# EAGLE design eTapper1main48 (EAGLE 8.4.3)
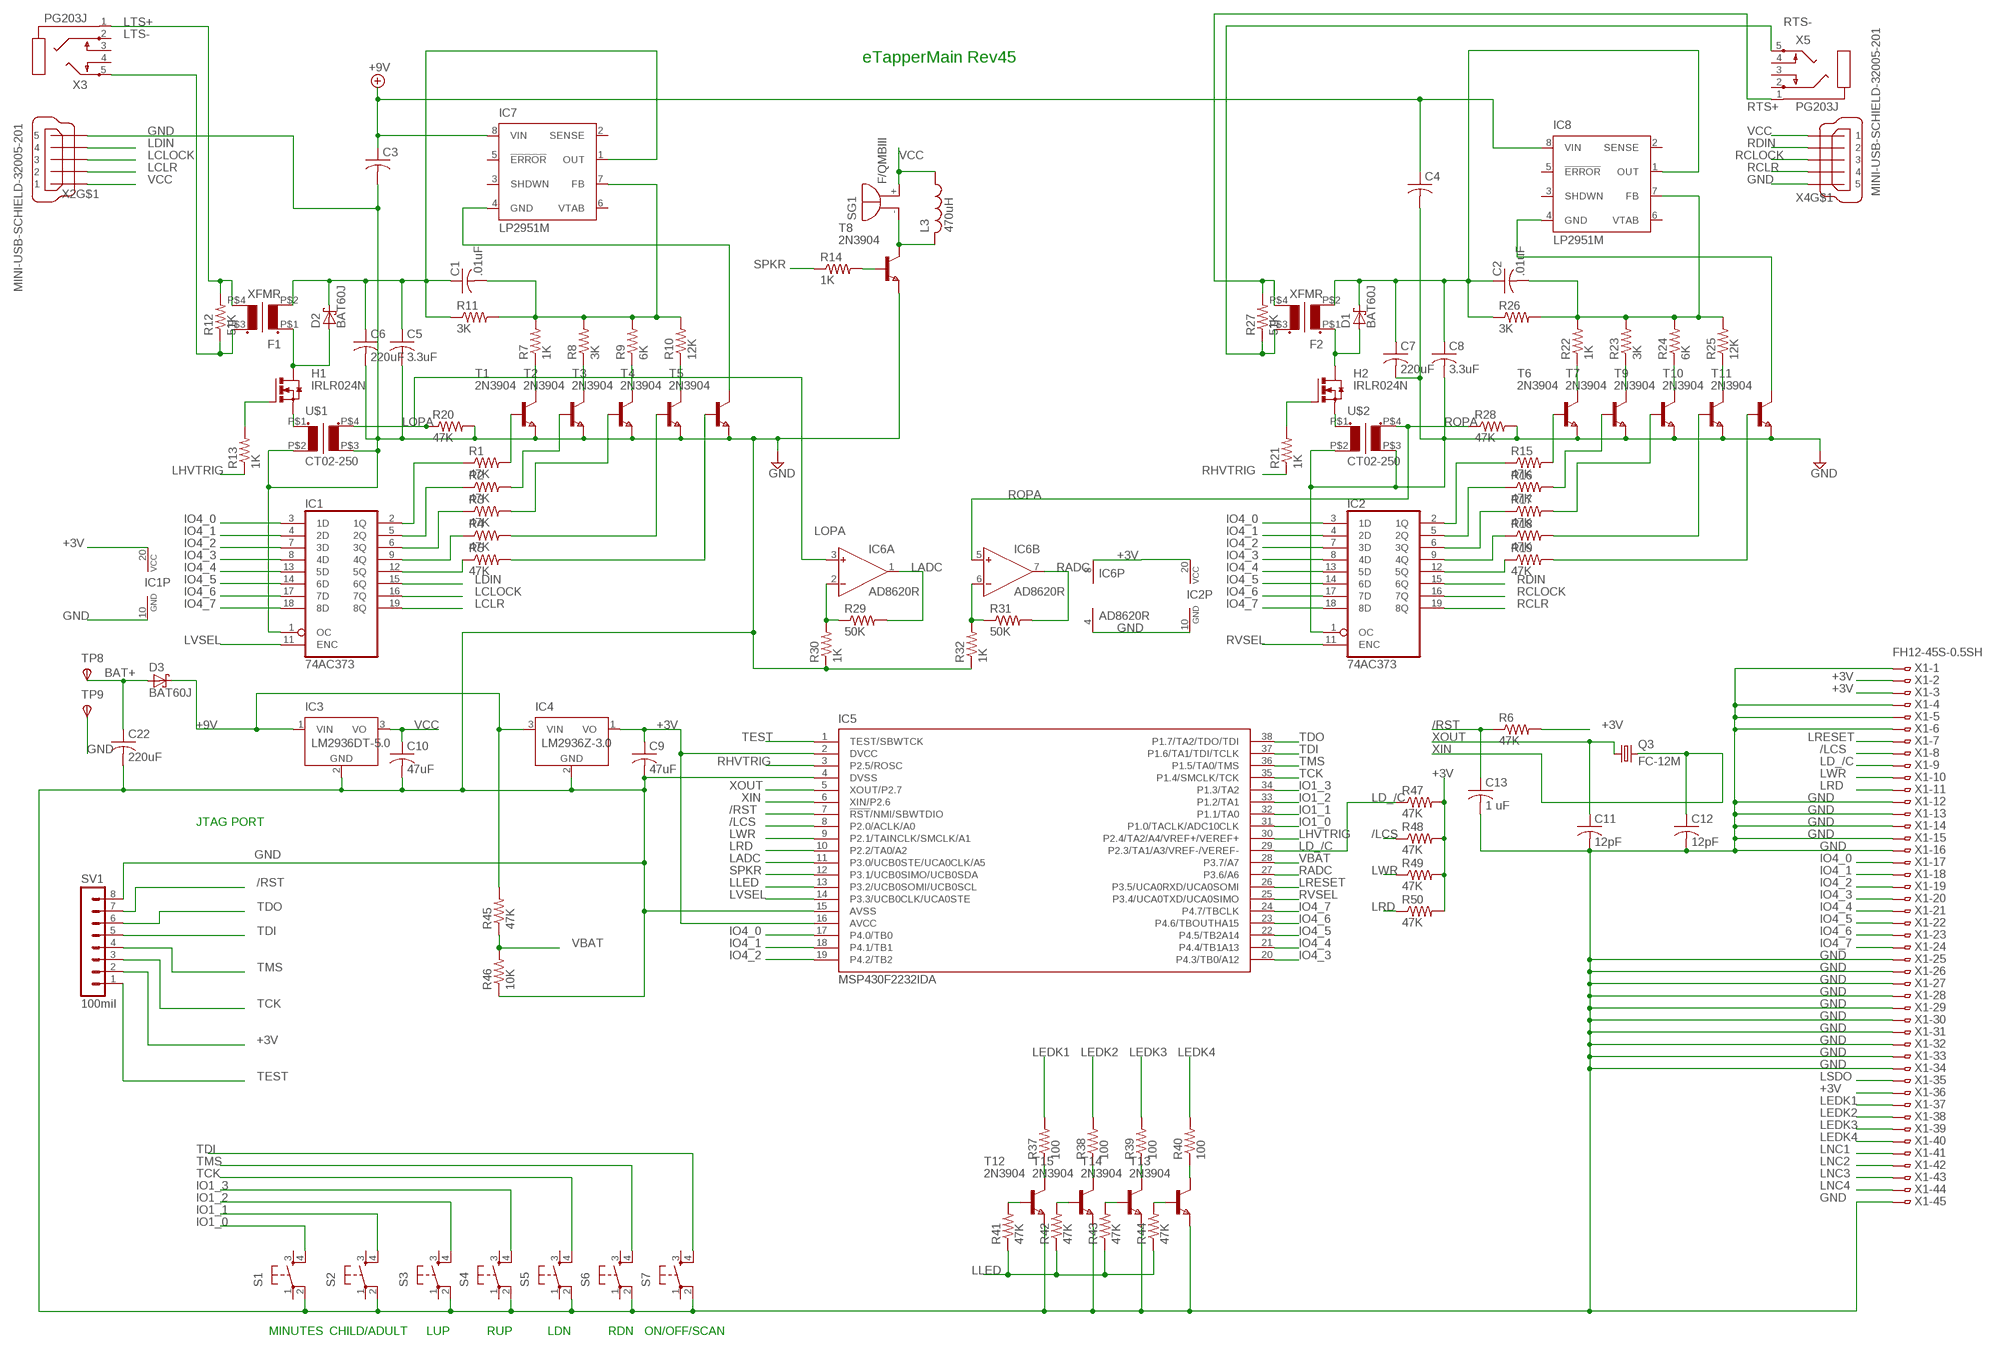
[diagram p0: schematic, sheet 1]

## Parts
C1  .01uF  C-USC0805  [C0805]
C2  .01uF  C-USC0805  [C0805]
C3  C-USC1206  [C1206]
C4  C-USC1206  [C1206]
C5  3.3uF  C-USC0805  [C0805]
C6  220uF  C-USC1206  [C1206]
C7  220uF  C-USC1206  [C1206]
C8  3.3uF  C-USC0805  [C0805]
C9  47uF  C-USC1206  [C1206]
C10  47uF  C-USC1206  [C1206]
C11  12pF  C-USC0805  [C0805]
C12  12pF  C-USC0805  [C0805]
C13  1 uF  C-USC0805  [C0805]
C22  220uF  C-USC1206  [C1206]
D1  BAT60J  [SOD323_ST]
D2  BAT60J  [SOD323_ST]
D3  BAT60J  [SOD323_ST]
F1  XFMR  [XFMR]
F2  XFMR  [XFMR]
H1  IRLR024N  [D-PAK_TO252AA]
H2  IRLR024N  [D-PAK_TO252AA]
IC1  74AC373  [SO20]
IC2  74AC373  [SO20]
IC3  LM2936DT-5.0  [TO252]
IC4  LM2936Z-3.0  [TO92]
IC5  MSP430F2232IDA  [TSSOP38_R-PDSO-G38-DA]
IC6  AD8620R  [SO8]
IC7  LP2951M  [SO08]
IC8  LP2951M  [SO08]
L3  470uH  L-USL2825P  [L2825P]
Q3  FC-12M  [FC-12M]
R1  47K  R-US_R0402  [R0402]
R2  47K  R-US_R0402  [R0402]
R3  47K  R-US_R0402  [R0402]
R4  47K  R-US_R0402  [R0402]
R5  47K  R-US_R0402  [R0402]
R6  47K  R-US_R0402  [R0402]
R7  1K  R-US_R0402  [R0402]
R8  3K  R-US_R0402  [R0402]
R9  6K  R-US_R0402  [R0402]
R10  12K  R-US_R0402  [R0402]
R11  3K  R-US_R0402  [R0402]
R12  51K  R-US_R0402  [R0402]
R13  1K  R-US_R0402  [R0402]
R14  1K  R-US_R0402  [R0402]
R15  47K  R-US_R0402  [R0402]
R16  47K  R-US_R0402  [R0402]
R17  47K  R-US_R0402  [R0402]
R18  47K  R-US_R0402  [R0402]
R19  47K  R-US_R0402  [R0402]
R20  47K  R-US_R0402  [R0402]
R21  1K  R-US_R0402  [R0402]
R22  1K  R-US_R0402  [R0402]
R23  3K  R-US_R0402  [R0402]
R24  6K  R-US_R0402  [R0402]
R25  12K  R-US_R0402  [R0402]
R26  3K  R-US_R0402  [R0402]
R27  51K  R-US_R0402  [R0402]
R28  47K  R-US_R0402  [R0402]
R29  50K  R-US_R0402  [R0402]
R30  1K  R-US_R0402  [R0402]
R31  50K  R-US_R0402  [R0402]
R32  1K  R-US_R0402  [R0402]
R37  100  R-US_R0402  [R0402]
R38  100  R-US_R0402  [R0402]
R39  100  R-US_R0402  [R0402]
R40  100  R-US_R0402  [R0402]
R41  47K  R-US_R0402  [R0402]
R42  47K  R-US_R0402  [R0402]
R43  47K  R-US_R0402  [R0402]
R44  47K  R-US_R0402  [R0402]
R45  47K  R-US_R0402  [R0402]
R46  10K  R-US_R0402  [R0402]
R47  47K  R-US_R0402  [R0402]
R48  47K  R-US_R0402  [R0402]
R49  47K  R-US_R0402  [R0402]
R50  47K  R-US_R0402  [R0402]
S1  10-XX  [B3F-10XX]
S2  10-XX  [B3F-10XX]
S3  10-XX  [B3F-10XX]
S4  10-XX  [B3F-10XX]
S5  10-XX  [B3F-10XX]
S6  10-XX  [B3F-10XX]
S7  10-XX  [B3F-10XX]
SG1  F/QMBIII  [F/QMBIII]
SV1  100mil  MA08-1  [MA08-1]
T1  2N3904  NPNSOT23  [SOT-23]
T2  2N3904  NPNSOT23  [SOT-23]
T3  2N3904  NPNSOT23  [SOT-23]
T4  2N3904  NPNSOT23  [SOT-23]
T5  2N3904  NPNSOT23  [SOT-23]
T6  2N3904  NPNSOT23  [SOT-23]
T7  2N3904  NPNSOT23  [SOT-23]
T8  2N3904  NPNSOT23  [SOT-23]
T9  2N3904  NPNSOT23  [SOT-23]
T10  2N3904  NPNSOT23  [SOT-23]
T11  2N3904  NPNSOT23  [SOT-23]
T12  2N3904  NPNSOT23  [SOT-23]
T13  2N3904  NPNSOT23  [SOT-23]
T14  2N3904  NPNSOT23  [SOT-23]
T15  2N3904  NPNSOT23  [SOT-23]
TP8  TPSPAD1-20  [P1-20]
TP9  TPSPAD1-20  [P1-20]
U$1  CT02-250  [CT02-250]
U$2  CT02-250  [CT02-250]
X1  FH12-45S-0.5SH  [FH12-45S-0.5SH]
X2  MINI-USB-SCHIELD-32005-201  [32005-201]
X3  PG203J  [PG203J]
X4  MINI-USB-SCHIELD-32005-201  [32005-201]
X5  PG203J  [PG203J]

## Nets
+3V [+3V]: C9.1 IC1.20(VCC) IC2.20(VCC) IC4.1(VO) IC5.2(DVCC) IC5.16(AVCC) IC6.8(P:V+) R6.2 R47.2 R48.2 R49.2 R50.2 SV1.2 X1.2 X1.3 X1.36
+9V [+9V]: C3.1 C4.1 D3.C IC3.1(VIN) IC4.3(VIN) IC7.8(VIN) IC8.8(VIN) R45.2
/LCS: IC5.8(P2.0/ACLK/A0) R48.1 X1.8
/RST: C13.1 IC5.7(!RST!/NMI/SBWTDIO) R6.1 SV1.7
BAT+ [BAT+]: C22.1 D3.A TP8.TP(PP)
GND [GND]: C3.2 C4.2 C5.2 C6.2 C7.2 C8.2 C9.2 C10.2 C11.2 C12.2 C13.2 C22.2 IC1.1(OC) IC1.10(GND) IC2.1(OC) IC2.10(GND) IC3.2(GND) IC4.2(GND) IC5.4(DVSS) IC5.15(AVSS) IC6.4(P:V-) R20.2 R28.2 R30.1 R32.1 R46.1 S1.2(P1) S2.2(P1) S3.2(P1) S4.2(P1) S5.2(P1) S6.2(P1) S7.2(P1) SV1.8 T1.2(E) T2.2(E) T3.2(E) T4.2(E) T5.2(E) T6.2(E) T7.2(E) T8.2(E) T9.2(E) T10.2(E) T11.2(E) T12.2(E) T13.2(E) T14.2(E) T15.2(E) TP9.TP(PP) U$1.P$2(P2) U$1.P$3(S2) U$2.P$2(P2) U$2.P$3(S2) X1.1 X1.4 X1.5 X1.6 X1.12 X1.13 X1.14 X1.15 X1.16 X1.25 X1.26 X1.27 X1.28 X1.29 X1.30 X1.31 X1.32 X1.33 X1.34 X1.45 X2.5 X4.5
IO1_0: IC5.31(P1.0/TACLK/ADC10CLK) S1.4(S1)
IO1_1: IC5.32(P1.1/TA0) S2.4(S1)
IO1_2: IC5.33(P1.2/TA1) S3.4(S1)
IO1_3: IC5.34(P1.3/TA2) S4.4(S1)
IO4_0: IC1.3(1D) IC2.3(1D) IC5.17(P4.0/TB0) X1.17
IO4_1: IC1.4(2D) IC2.4(2D) IC5.18(P4.1/TB1) X1.18
IO4_2: IC1.7(3D) IC2.7(3D) IC5.19(P4.2/TB2) X1.19
IO4_3: IC1.8(4D) IC2.8(4D) IC5.20(P4.3/TB0/A12) X1.20
IO4_4: IC1.13(5D) IC2.13(5D) IC5.21(P4.4/TB1A13) X1.21
IO4_5: IC1.14(6D) IC2.14(6D) IC5.22(P4.5/TB2A14) X1.22
IO4_6: IC1.17(7D) IC2.17(7D) IC5.23(P4.6/TBOUTHA15) X1.23
IO4_7: IC1.18(8D) IC2.18(8D) IC5.24(P4.7/TBCLK) X1.24
LADC: IC5.11(P3.0/UCB0STE/UCA0CLK/A5) IC6.1(A:OUT) R29.2
LCLOCK: IC1.16(7Q) X2.3
LCLR: IC1.19(8Q) X2.2
LD_/C: IC5.29(P2.3/TA1/A3/VREF-/VEREF-) R47.1 X1.9
LDIN: IC1.15(6Q) X2.4
LEDK1: R37.2 X1.37
LEDK2: R38.2 X1.38
LEDK3: R39.2 X1.39
LEDK4: R40.2 X1.40
LHVTRIG: IC5.30(P2.4/TA2/A4/VREF+/VEREF+) R13.1
LLED: IC5.13(P3.2/UCB0SOMI/UCB0SCL) R41.1 R42.1 R43.1 R44.1
LNC1: X1.41
LNC2: X1.42
LNC3: X1.43
LNC4: X1.44
LOPA: IC6.3(A:IN+) R20.1 U$1.P$4(S1)
LRD: IC5.10(P2.2/TA0/A2) R50.1 X1.11
LRESET: IC5.26(P3.5/UCA0RXD/UCA0SOMI) X1.7
LSDO: X1.35
LTS+: F1.P$4(S2) R12.2 X3.1
LTS-: F1.P$3(S1) R12.1 X3.5
LVSEL: IC1.11(ENC) IC5.14(P3.3/UCB0CLK/UCA0STE)
LWR: IC5.9(P2.1/TAINCLK/SMCLK/A1) R49.1 X1.10
N$1: IC1.2(1Q) R1.1
N$2: IC1.5(2Q) R2.1
N$3: IC1.6(3Q) R3.1
N$4: IC1.9(4Q) R4.1
N$5: IC1.12(5Q) R5.1
N$6: L3.2 SG1.-(+) T8.1(C)
N$7: R4.2 T4.3(B)
N$8: R5.2 T5.3(B)
N$9: D2.A F1.P$1(P1) H1.4(D)
N$10: R7.1 T1.1(C)
N$11: R8.1 T2.1(C)
N$12: R9.1 T3.1(C)
N$13: R1.2 T1.3(B)
N$14: R2.2 T2.3(B)
N$15: R3.2 T3.3(B)
N$16: R10.1 T4.1(C)
N$17: C1.2 IC7.7(FB) R7.2 R8.2 R9.2 R10.2 R11.2
N$18: C1.1 C5.1 C6.1 D2.C F1.P$2(P2) IC7.1(OUT) R11.1
N$19: D1.A F2.P$1(P1) H2.4(D)
N$20: IC2.2(1Q) R15.1
N$21: H1.1(G) R13.2
N$22: R14.2 T8.3(B)
N$23 [GND]: H1.3(S) U$1.P$1(P1)
N$24: IC2.5(2Q) R16.1
N$25: IC2.6(3Q) R17.1
N$26: IC2.9(4Q) R18.1
N$27: IC2.12(5Q) R19.1
N$28: R44.2 T13.3(B)
N$29: R15.2 T6.3(B)
N$30: R16.2 T7.3(B)
N$31: R17.2 T9.3(B)
N$32: R18.2 T10.3(B)
N$33: R19.2 T11.3(B)
N$35: R22.1 T6.1(C)
N$36: R23.1 T7.1(C)
N$37: R24.1 T9.1(C)
N$38: R25.1 T10.1(C)
N$39: C2.2 IC8.7(FB) R22.2 R23.2 R24.2 R25.2 R26.2
N$40: C2.1 C7.1 C8.1 D1.C F2.P$2(P2) IC8.1(OUT) R26.1
N$41: R37.1 T12.1(C)
N$42: H2.1(G) R21.2
N$43: R38.1 T15.1(C)
N$44: R39.1 T14.1(C)
N$45: IC7.4(GND) T5.1(C)
N$46: R40.1 T13.1(C)
N$47: IC8.4(GND) T11.1(C)
N$48: R43.2 T14.3(B)
N$49: R41.2 T12.3(B)
N$50: R42.2 T15.3(B)
N$51 [GND]: H2.3(S) U$2.P$1(P1)
N$52: IC6.6(B:IN-) R31.1 R32.2
N$54: IC6.2(A:IN-) R29.1 R30.2
RADC: IC5.27(P3.6/A6) IC6.7(B:OUT) R31.2
RCLOCK: IC2.16(7Q) X4.3
RCLR: IC2.19(8Q) X4.4
RDIN: IC2.15(6Q) X4.2
RHVTRIG: IC5.3(P2.5/ROSC) R21.1
ROPA: IC6.5(B:IN+) R28.1 U$2.P$4(S1)
RTS+: F2.P$4(S2) R27.2 X5.1
RTS-: F2.P$3(S1) R27.1 X5.5
RVSEL: IC2.11(ENC) IC5.25(P3.4/UCA0TXD/UCA0SIMO)
SPKR: IC5.12(P3.1/UCB0SIMO/UCB0SDA) R14.1
TCK: IC5.35(P1.4/SMCLK/TCK) S5.4(S1) SV1.3
TDI: IC5.37(P1.6/TA1/TDI/TCLK) S7.4(S1) SV1.5
TDO: IC5.38(P1.7/TA2/TDO/TDI) SV1.6
TEST: IC5.1(TEST/SBWTCK) SV1.1
TMS: IC5.36(P1.5/TA0/TMS) S6.4(S1) SV1.4
VBAT: IC5.28(P3.7/A7) R45.1 R46.2
VCC [VCC]: C10.1 IC3.3(VO) L3.1 SG1.+(-) X2.1 X4.1
XIN: C12.1 IC5.6(XIN/P2.6) Q3.2
XOUT: C11.1 IC5.5(XOUT/P2.7) Q3.1
Unconnected: IC7.2(SENSE) IC7.3(SHDWN) IC7.5(!ERROR) IC7.6(VTAB) IC8.2(SENSE) IC8.3(SHDWN) IC8.5(!ERROR) IC8.6(VTAB) S1.1(P) S1.3(S) S2.1(P) S2.3(S) S3.1(P) S3.3(S) S4.1(P) S4.3(S) S5.1(P) S5.3(S) S6.1(P) S6.3(S) S7.1(P) S7.3(S) X2.M1(S:S1) X2.M2(S:S2) X2.M3(S:S3) X2.M4(S:S4) X3.2 X3.3 X3.4 X4.M1(S:S1) X4.M2(S:S2) X4.M3(S:S3) X4.M4(S:S4) X5.2 X5.3 X5.4

## Notes on the sheet
- eTapperMain Rev45
- JTAG PORT
- MINUTES | CHILD/ADULT | LUP | RUP | LDN | RDN | ON/OFF/SCAN

## Library data of the parts
C1-C13 C22 = rcl:C-US: CAPACITOR, American symbol
D1-D3 = diode:BAT60J: Schottky barrier diode Source: www.st.com, BAT60J.pdf
F1 F2 = XFMR1:XFMR: Transformer 1"X1" 0.4"X0.4" hole separation for e_tapper
H1 H2 = IRLR024N:IRLR024N: IRLR024N HEXFET Power Mosfet N channel Infeneon Technology TO-251AA IPAK
IC1 IC2 = 74373_SO20:74*373: Octal D type transparent LATCH, edge triggered
IC3 = national-semiconductor:LM2936?*: Ultra-Low Quiescent Current LDO Voltage Regulator Source: Data sheet <http://www.national.com/ds/LM/LM2936.pdf>; MF: NATIONAL SEMICONDUCTOR; MPN: LM2936DT-5.0/NOPB; OC_FARNELL: 1286864; OC_NEWARK: 41K4501
IC4 = national-semiconductor:LM2936?*: Ultra-Low Quiescent Current LDO Voltage Regulator Source: Data sheet <http://www.national.com/ds/LM/LM2936.pdf>; MF: NATIONAL SEMICONDUCTOR; MPN: LM2936Z-3.0/NOPB; OC_FARNELL: 1312709; OC_NEWARK: 41K4531
IC5 = texas:MSP430F22*2IDA: MIXED SIGNAL MICROCONTROLLER Source: http://focus.ti.com/lit/ds/symlink/msp430f2274.pdf; MPN: MSP430F2232IDA; OC_FARNELL: 1610178; OC_NEWARK: 28M6312
IC6 = analog-devices:AD8620: Precision, Very Low Noise, Low Input Bias Current, Wide Bandwidth JFET Operational Amplifiers Source: http://www.analog.com/static/imported-files/data_sheets/AD8610_8620.pdf; MF: ALTERA CORPORATION; MPN: AD8620ARZ; OC_FARNELL: 9994386; OC_NEWARK: 59K6972
IC7 IC8 = national-semiconductor:LP2951: Adjustable Micropower Voltage Regulator Source: http://www.national.com/ds/LP/LP2950.pdf; MF: FAIRCHILD SEMICONDUCTOR; MPN: LP2951CM; OC_FARNELL: 9488561; OC_NEWARK: 78K6014
L3 = rcl:L-US: INDUCTOR, American symbol
Q3 = crystal:FC-12M: kHz RANGE CRYSTAL UNIT LOW PROFILE SMD Source: Epson Toyocom FC-12M.pdf
R1-R32 R37-R50 = resistor:R-US_: RESISTOR, American symbol
S1-S7 = switch-omron:10-XX: OMRON SWITCH; MPN: B3F-1000; OC_FARNELL: 176432; OC_NEWARK: 36M3542
SG1 = buzzer:F/QMBIII: BUZZER Source: Buerklin; OC_FARNELL: unknown; OC_NEWARK: unknown
SV1 = con-lstb:MA08-1: PIN HEADER; OC_FARNELL: unknown; OC_NEWARK: unknown
T1-T15 = zetex:NPNSOT23: NPN TRANSISTOR; MPN: DSS20201L-7; OC_FARNELL: 1710688; OC_NEWARK: 25R4555
TP8 TP9 = testpad:TPS: TEST PIN
U$1 U$2 = CT02-250:CT02-250: Current Transformer ICE Components 1:250 turns ratio
X1 = con-hirose:FH12-45S-0.5S: 0.5mm Pitch Connectors For FPC/FFC Source: Data sheet <http://www.hirose.co.jp/cataloge_hp/e58605370.pdf>; OC_FARNELL: unknown; OC_NEWARK: unknown
X2 X4 = con-cypressindustries:MINI-USB-SCHIELD-: MINI USB-B Conector Source: www.cypressindustries.com; OC_FARNELL: unknown; OC_NEWARK: unknown
X3 X5 = con-hirschmann:PG203J: MIC/HEADPHONE JACK KS-S stereo microphone/headphone jack PG203JN (Schukat); OC_FARNELL: unknown; OC_NEWARK: unknown

## Module LP2951
Ports: 

### Library data of the parts

## Net classes
1 GND: width 0.305 mm, clearance 0.152 mm
2 BAT+: width 0.305 mm, clearance 0.152 mm
3 +9V: width 0.305 mm, clearance 0.152 mm
4 +3V: width 0.305 mm, clearance 0.152 mm
5 VCC: width 0.305 mm, clearance 0.152 mm

## Board
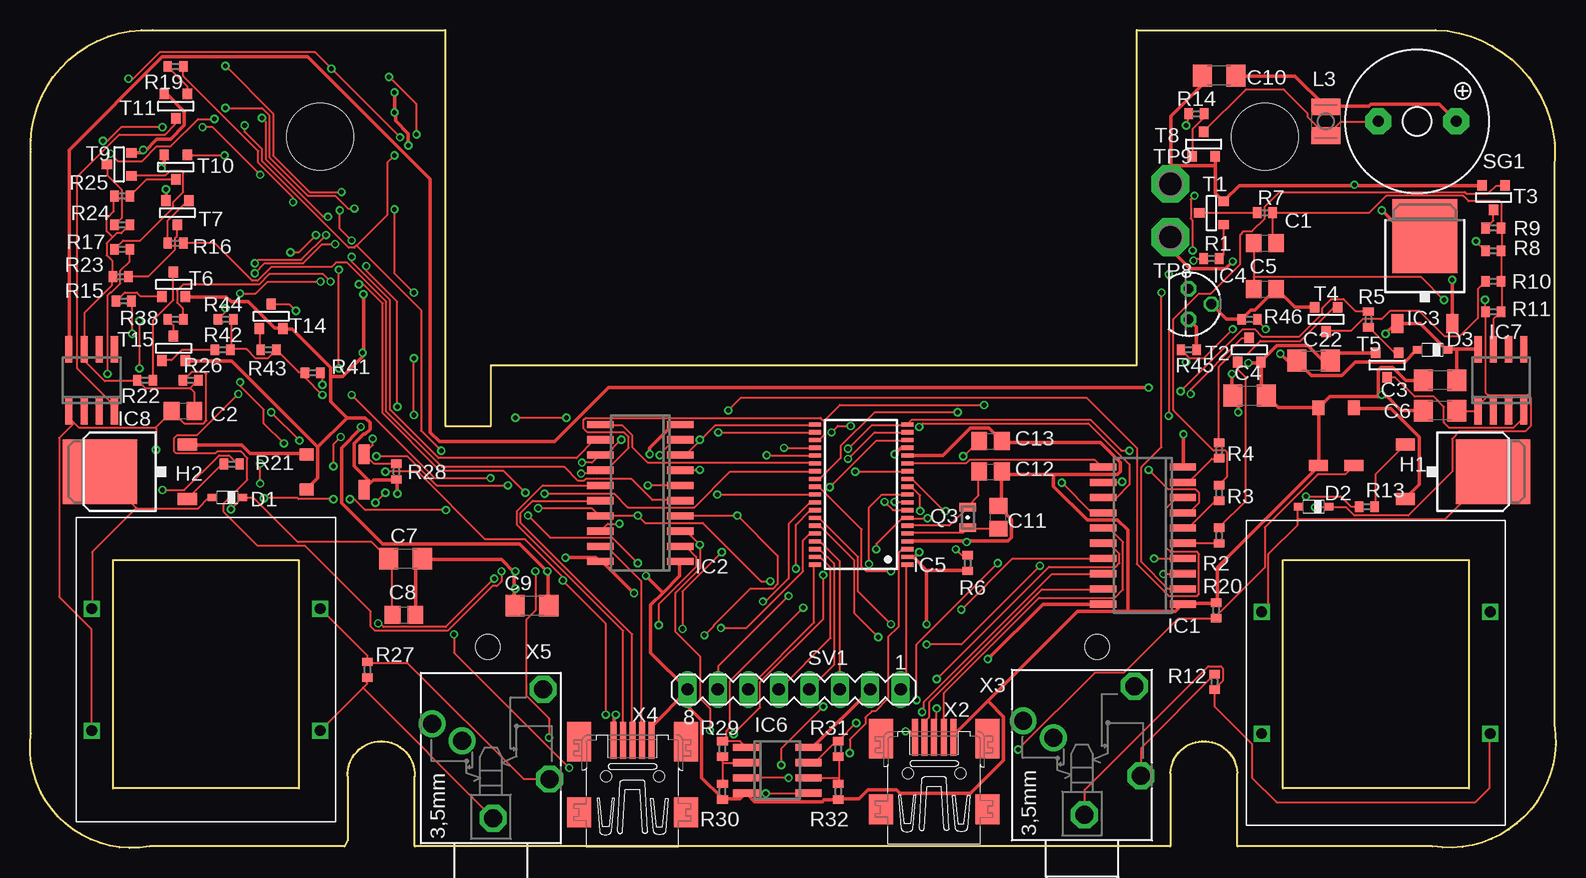
[diagram p1: board, top side]
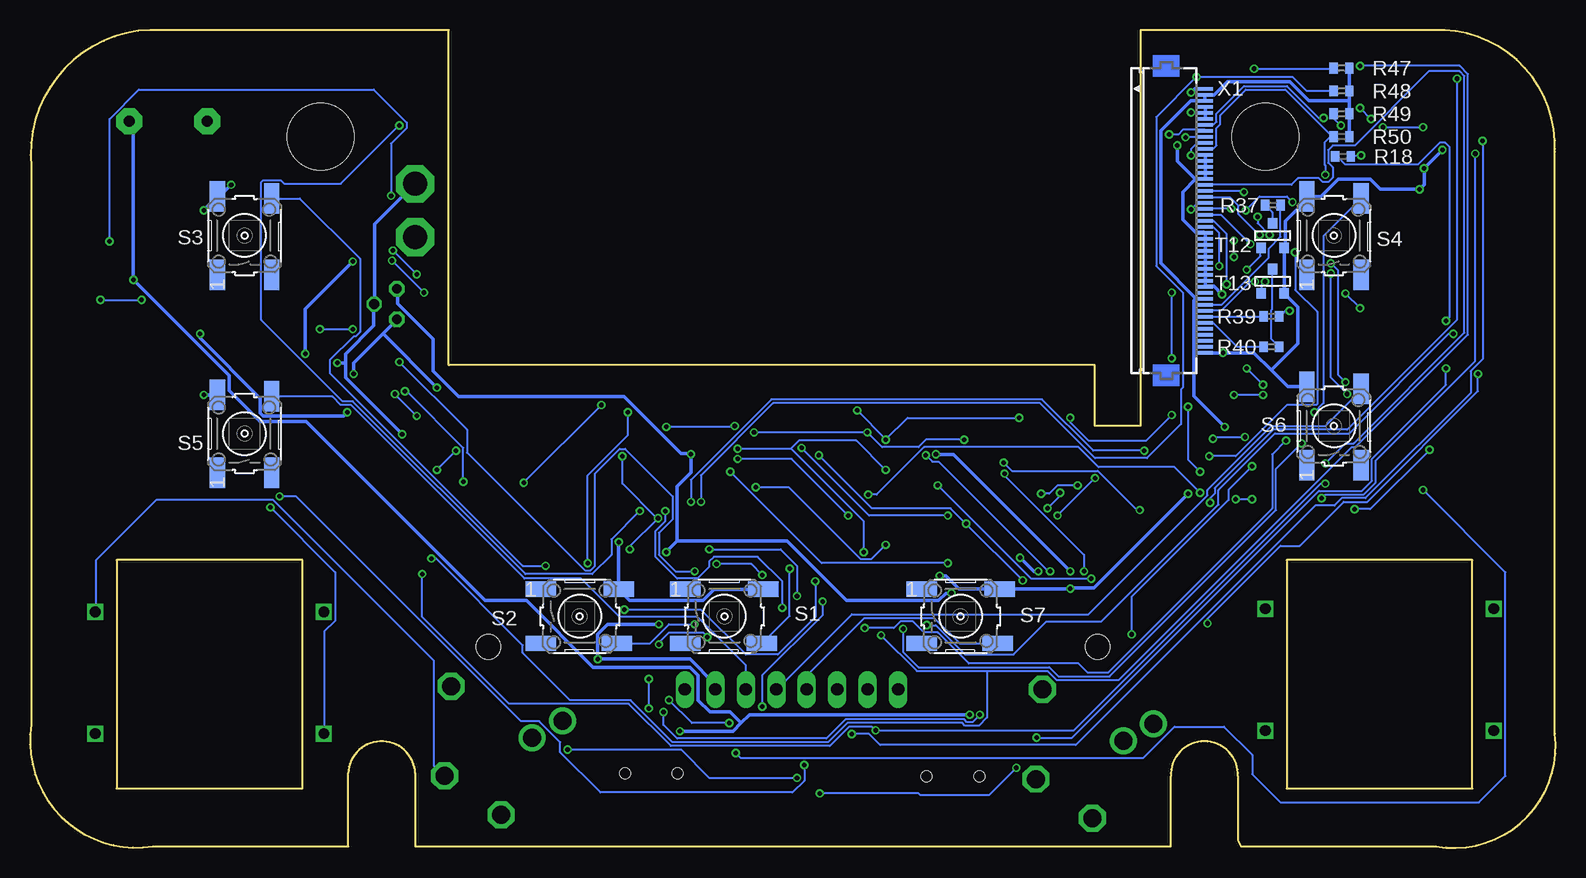
[diagram p2: board, bottom side, seen from below]

Size 127.17 x 68.21 mm. Coordinates in mm from the lower left corner, seen from the top.
Outline: 0.06,58.04 0.06,58.3 0.06,9.53
Outline: 0.06,58.04 0.06,9.53
Outline: 0.06,58.04 arc-96 10.22,68.2 34.61,68.2 34.61,35.18 38.42,35.18 38.42,40.26 92.27,40.26 92.27,68.2 117.16,68.2 arc-94 127.06,56.77 127.06,10.29 arc-108 116.9,0.13 100.65,0.13 100.65,6.23 arc175 95.06,6.23 95.06,0.13 32.07,0.13 32.07,5.97 arc185 26.48,5.97 26.48,0.64 26.23,0.13 9.97,0.13 arc-107 0.06,9.53
Outline: 104.46,24.01 119.95,24.01 119.95,4.96 104.46,4.96 104.46,24.01
Outline: 6.92,24.01 22.42,24.01 22.42,4.96 6.92,4.96 6.92,24.01
Copper layers (1*16): Top 0.035mm / dielectric 30mil / Bottom 0.035mm
Design rules "default *": minimum track width 6mil, minimum drill 15mil, track to track 6mil, track to pad 6mil, pad to pad 6mil, via to via 6mil, smd to smd 6mil, copper to edge 40mil, drill to drill 6mil, minimum pad ring 6mil, minimum via ring 6mil, stop-mask expansion 4mil, vias tented up to drill 0mil, thermal gap 10mil
Holes 5.59 mm at 24.19,59.31 102.93,59.31
Holes 2.03 mm at 38.16,16.77 88.96,16.77

### Footprints (pad centres in the part's own frame; a part is rotated, then mirrored left to right if it is on the bottom)
C0805 = smd 1.3 x 1.5: 1 -0.95,0; 2 0.95,0
C1206 = smd 1.6 x 1.8: 1 -1.4,0; 2 1.4,0
SOD323_ST = smd 0.8 x 0.6: A 1.25,0; C -1.25,0
XFMR = drill 0.889 square: P$1 -10.16,5.08; P$2 -10.16,-5.08; P$3 8.89,5.08; P$4 8.89,-5.08
D-PAK_TO252AA = smd 1 x 1.6: 1 -2.28,-4.8; 3 2.28,-4.8 | smd 5.4 x 6.2: 4 0,2.5
SO20 = smd 0.6 x 2.2: 1 -5.715,-3.33; 2 -4.445,-3.33; 3 -3.175,-3.33; 4 -1.905,-3.33; 5 -0.635,-3.33; 6 0.635,-3.33; 7 1.905,-3.33; 8 3.175,-3.33; 9 4.445,-3.33; 10 5.715,-3.33; 11 5.715,3.33; 12 4.445,3.33; 13 3.175,3.33; 14 1.905,3.33; 15 0.635,3.33; 16 -0.635,3.33; 17 -1.905,3.33; 18 -3.175,3.33; 19 -4.445,3.33; 20 -5.715,3.33
TO252 = smd 1 x 1.6: 1 -2.28,-4.8; 3 2.28,-4.8 | smd 5.4 x 6.2: 2 0,2.5
TO92 = drill 0.813 pad 1.27 octagon: 1 -1.27,0; 2 0,1.905; 3 1.27,0
TSSOP38_R-PDSO-G38-DA = smd 0.35 x 1: 1 -5.85,-3.85; 2 -5.2,-3.85; 3 -4.55,-3.85; 4 -3.9,-3.85; 5 -3.25,-3.85; 6 -2.6,-3.85; 7 -1.95,-3.85; 8 -1.3,-3.85; 9 -0.65,-3.85; 10 0,-3.85; 11 0.65,-3.85; 12 1.3,-3.85; 13 1.95,-3.85; 14 2.6,-3.85; 15 3.25,-3.85; 16 3.9,-3.85; 17 4.55,-3.85; 18 5.2,-3.85; 19 5.85,-3.85; 20 5.85,3.85; 21 5.2,3.85; 22 4.55,3.85; 23 3.9,3.85; 24 3.25,3.85; 25 2.6,3.85; 26 1.95,3.85; 27 1.3,3.85; 28 0.65,3.85; 29 0,3.85; 30 -0.65,3.85; 31 -1.3,3.85; 32 -1.95,3.85; 33 -2.6,3.85; 34 -3.25,3.85; 35 -3.9,3.85; 36 -4.55,3.85; 37 -5.2,3.85; 38 -5.85,3.85
SO8 = smd 0.6 x 2.2: 1 -1.905,-2.6; 2 -0.635,-2.6; 3 0.635,-2.6; 4 1.905,-2.6; 5 1.905,2.6; 6 0.635,2.6; 7 -0.635,2.6; 8 -1.905,2.6
SO08 = smd 0.6 x 2.2: 1 -1.905,-2.6; 2 -0.635,-2.6; 3 0.635,-2.6; 4 1.905,-2.6; 5 1.905,2.6; 6 0.635,2.6; 7 -0.635,2.6; 8 -1.905,2.6
L2825P = smd 1.4 x 2.4: 1 -1.2,0; 2 1.2,0
FC-12M = smd 0.7 x 1.4: 1 -0.85,0; 2 0.85,0
R0402 = smd 0.7 x 0.9: 1 -0.65,0; 2 0.65,0
B3F-10XX = smd 2.54 x 1.27: 1 -3.251,2.261; 2 3.251,2.261; 3 -3.251,-2.261; 4 3.099,-2.261
F/QMBIII = drill 0.914 pad 2.159 octagon: + 3.251,0; - -3.251,0
MA08-1 = drill 1.016 long: 1 -8.89,0; 2 -6.35,0; 3 -3.81,0; 4 -1.27,0; 5 1.27,0; 6 3.81,0; 7 6.35,0; 8 8.89,0
SOT-23 = smd 0.787 x 0.889: 1 0.025,-1.016; 2 -0.94,1.016; 3 0.991,1.016
P1-20 = drill 2.007 pad 3.15 octagon: TP 0,0
CT02-250 = smd 1 x 1.2: P$1 -1.45,-2.4; P$2 1.5,-2.4 | smd 1.6 x 0.9: P$3 1.5,2.4; P$4 -1.45,2.4
FH12-45S-0.5SH = smd 0.3 x 1.3: 1 -13,3.25; 2 -12.5,3.25; 3 -12,3.25; 4 -11.5,3.25; 5 -11,3.25; 6 -10.5,3.25; 7 -10,3.25; 8 -9.5,3.25; 9 -9,3.25; 10 -8.5,3.25; 11 -8,3.25; 12 -7.5,3.25; 13 -7,3.25; 14 -6.5,3.25; 15 -6,3.25; 16 -5.5,3.25; 17 -5,3.25; 18 -4.5,3.25; 19 -4,3.25; 20 -3.5,3.25; 21 -3,3.25; 22 -2.5,3.25; 23 -2,3.25; 24 -1.5,3.25; 25 -1,3.25; 26 -0.5,3.25; 27 0,3.25; 28 0.5,3.25; 29 1,3.25; 30 1.5,3.25; 31 2,3.25; 32 2.5,3.25; 33 3,3.25; 34 3.5,3.25; 35 4,3.25; 36 4.5,3.25; 37 5,3.25; 38 5.5,3.25; 39 6,3.25; 40 6.5,3.25; 41 7,3.25; 42 7.5,3.25; 43 8,3.25; 44 8.5,3.25; 45 9,3.25
32005-201 = smd 3.1 x 0.5: 1 3,1.6; 2 3,0.8; 3 3,0; 4 3,-0.8; 5 3,-1.6 | smd 2.5 x 2: M1 -3,-4.45; M2 -3,4.45 | smd 3.3 x 2: M3 2.9,4.45; M4 2.9,-4.45 | hole 0.9: 0,2.2; 0,-2.2
PG203J = drill 1.499 octagon: 1 -5.004,-0.203; 4 5.74,-4.369; 5 -1.753,-4.902 | drill 1.499: 2 2.845,4.902; 3 1.448,2.388

### Placement (x,y rotation side)
C1  102.93,50.42 0 top
C2  12.76,36.45 0 top
C3  117.54,38.99 180 top
C4  101.66,37.72 0 top
C5  102.93,46.61 0 top
C6  117.54,36.45 180 top
C7  31.31,24.14 0 top
C8  31.18,19.44 0 top
C9  41.85,20.2 180 top
C10  99.12,64.39 180 top
C11  80.71,27.56 90 top
C12  80.07,31.37 0 top
C13  80.07,33.91 0 top
C22  107,40.65 0 top
D1  16.45,29.22 180 top
D2  107,28.45 180 top
D3  116.9,41.53 180 top
DRILEGEND  [DRILEGEND]  -4.51,-8.34 0 top  (outside the outline)
F1  112.84,14.61 0 top
F2  15.3,14.86 0 top
H1  119.44,31.37 270 top
H2  8.32,31.37 90 top
IC1  92.77,26.04 90 top
IC2  50.86,29.6 90 top
IC3  116.27,48.52 0 top
IC4  96.58,45.34 270 top
IC5  69.28,29.47 90 top
IC6  62.29,6.48 270 top
IC7  122.62,38.99 0 top
IC8  5.14,38.99 0 top
L3  108.01,60.58 270 top
Q3  78.17,27.56 90 top
R1  98.49,49.15 0 top
R2  99.12,26.04 90 top
R3  99.12,29.6 90 top
R4  99.12,33.15 90 top
R5  111.57,44.07 270 top
R6  78.17,23.75 270 top
R7  102.93,52.96 0 top
R8  121.98,49.79 0 top
R9  121.98,51.69 0 top
R10  121.98,47.25 0 top
R11  121.98,44.71 0 top
R12  98.74,13.85 270 top
R13  111.44,28.45 0 top
R14  97.22,61.22 0 top
R15  7.81,45.6 180 top
R16  12.13,50.42 180 top
R17  7.68,49.92 180 top
R18  17.72,57.66 0 bottom
R19  12.13,65.16 180 top
R20  98.87,19.82 90 top
R21  16.83,32.01 180 top
R22  9.59,38.99 180 top
R23  7.56,47.63 180 top
R24  7.68,51.95 0 top
R25  7.68,54.36 180 top
R26  13.4,38.99 0 top
R27  28.13,14.86 270 top
R28  30.54,31.37 270 top
R29  57.72,8.26 90 top
R30  57.72,4.7 90 top
R31  67.37,8.26 90 top
R32  67.37,4.7 90 top
R37  23.56,53.6 0 bottom
R38  12.13,44.07 0 top
R39  23.69,44.33 180 bottom
R40  23.69,41.79 180 bottom
R41  23.56,39.63 0 top
R42  16.07,41.53 180 top
R43  19.88,41.53 180 top
R44  16.32,44.07 180 top
R45  96.58,41.53 0 top
R46  101.66,44.07 0 top
R47  17.84,65.03 0 bottom
R48  17.84,63.12 0 bottom
R49  17.84,61.22 0 bottom
R50  17.84,59.31 0 bottom
S1  69.28,19.31 0 bottom
S2  81.34,19.31 0 bottom
S3  109.28,51.06 90 bottom
S4  18.48,51.06 90 bottom
S5  109.28,34.55 90 bottom
S6  18.48,35.18 90 bottom
S7  49.59,19.31 0 bottom
SG1  115.63,60.58 0 top
SV1  63.69,13.21 180 top
T1  98.49,52.96 270 top
T2  101.66,41.53 180 top
T3  121.98,54.23 0 top
T4  108.01,44.07 0 top
T5  113.09,40.26 0 top
T6  12,47 180 top
T7  12.26,52.96 0 top
T8  97.85,58.68 180 top
T9  7.43,57.03 270 top
T10  12.13,56.77 0 top
T11  12.13,61.85 0 top
T12  23.56,51.06 180 bottom
T13  23.56,47.25 180 bottom
T14  20.13,44.33 180 top
T15  12,41.66 180 top
TP8  95.06,50.93 0 top
TP9  95.06,55.38 0 top
U$1  108.9,34.3 180 top
U$2  25.46,31.37 270 top
X1  32.45,50.3 270 bottom
X2  75.37,6.23 90 top
X3  87.69,7.75 90 top
X4  50.23,5.97 90 top
X5  38.42,7.5 90 top

### Tracks (layer width: path | path; a pad name or v marks a point on that pad's centre or on a via)
+3V  (via drill 0.38)
  Top 0.305: IC6.8 64.91,8.44 65.29,8.44 70.02,13.16 SV1.2 | IC1.20 84.42,20.33 v79.84,15.75 | v44.64,24.21 47.16,24.21 47.46,23.91 IC2.20 47.69,23.91 v50.36,21.24 | C9.1 43.19,20.25 43.19,22.99 v43.12,23.07 40.83,25.35 29.4,25.35 25.97,28.78 25.97,33.36 27.57,34.96 v27.57,35.11 | 74.74,23.14 78.17,23.14 R6.2 | 73.67,24.21 74.74,23.14 | 73.67,24.21 73.14,24.21 IC5.2 | v72.07,32.82 72.61,33.36 73.06,33.36 IC5.16 | 73.67,24.21 v74.13,24.67 | 74.74,23.14 v74.74,18.65
  Bottom 0.305: SV1.2 70.09,13.24 70.09,13.7 72.15,15.75 v79.84,15.75 79.84,17.81 79.01,18.65 v74.74,18.65 | R50.2 17.21,59.34 17.21,61.17 R49.2 17.21,61.32 17.21,62.31 | 17.21,62.31 17.21,63.07 R48.2 17.21,63.23 17.21,64.98 R47.2 | 30.01,45.85 32.91,48.75 32.91,59.8 30.39,62.31 29.25,62.31 | 30.01,45.85 29.93,45.78 29.25,45.78 X1.36 | 29.25,62.31 X1.3 | 29.25,62.31 29.25,62.77 X1.2 29.1,62.77 28.49,62.77 27.34,63.91 22.16,63.91 20.56,62.31 17.21,62.31 | v43.12,23.07 43.5,23.07 v44.64,24.21 | 73.22,25.58 73.22,30.16 72.07,31.3 v72.07,32.82 72.15,32.9 72.91,32.9 77.64,37.62 91.43,37.62 93.56,39.76 93.56,42.42 96.53,45.4 96.53,46.61 IC4.1 | v74.13,24.67 73.22,25.58 | v50.36,21.24 50.81,21.24 51.42,20.63 59.12,20.63 64.07,25.58 73.22,25.58 | v27.57,35.11 30.16,37.7 30.16,45.62 30.09,45.7 30.09,45.78 30.01,45.85
+9V  (via drill 0.38)
  Top 0.305: 118.94,41.59 120.69,41.59 IC7.8 | 118.94,41.59 118.17,41.59 D3.C 118.02,41.59 115.89,43.72 114.06,43.72 IC3.1 113.91,43.64 113.75,43.64 v112.99,42.88 | 118.94,41.59 C3.1 | R45.2 97.22,41.59 97.22,43.41 96.61,44.02 IC4.3 | v100.19,39.53 100.19,37.78 C4.1 100.34,37.62 100.72,37.24 v100.72,36.33 | v93.26,38.38 48.22,38.38 43.73,33.89 34.12,33.89 33.36,34.65 33.36,55.76 23.15,65.97 11.04,65.97 3.26,58.2 3.26,41.66 IC8.8
  Bottom 0.305: v100.19,39.53 100.19,40.44 97.75,42.88 | 97.75,42.88 96.61,44.02 IC4.3 | 97.75,42.88 v93.26,38.38 | v112.99,42.88 112.99,42.5 107.96,37.47 107.96,36.25 107.73,36.02 101.03,36.02 v100.72,36.33
/LCS  (via drill 0.38)
  Top 0.152: v29.93,64.29 32.22,62.01 v32.22,59.49 | v71.23,28.86 71.92,28.17 73.06,28.17 IC5.8
  Bottom 0.152: v32.22,59.49 31.46,59.49 31.08,59.87 29.25,59.87 X1.8 | R48.1 18.5,63.15 20.79,63.15 21.93,64.29 v29.93,64.29 33.29,60.94 33.29,48.52 31.08,46.31 31.08,38.38 31.23,38.23 31.23,35.34 34.05,32.52 38.39,32.52 42.96,37.09 65.21,37.09 71.23,31.07 v71.23,28.86
/RST  (via drill 0.38)
  Top 0.152: v77.18,24.9 77.64,24.44 78.17,24.44 R6.1 | v74.82,27.49 73.14,27.49 IC5.7 73.06,27.49 72.68,27.49 70.55,25.35 v70.55,24.9 | v77.79,32.67 77.86,32.67 79.08,33.89 C13.1 | v63.23,21.01 57.37,15.14 57.37,13.24 SV1.7
  Bottom 0.152: v77.18,24.9 77.18,25.13 v74.82,27.49 74.89,27.49 77.79,30.38 v77.79,32.67 | v63.23,21.01 63.23,23.53 64.6,24.9 v70.55,24.9
BAT+  (via drill 0.38)
  Top 0.305: D3.A 115.58,41.51 114.59,40.52 110.48,40.52 109.33,39.38 106.82,39.38 105.6,40.59 C22.1 105.45,40.67 104.76,40.67 v104.23,41.2 | v100.27,48.9 99.66,48.29 96.69,48.29 95.08,49.89 95.08,50.88 TP8.TP
  Bottom 0.305: v104.23,41.2 104.23,44.94 v100.27,48.9
GND  (via drill 0.38)
  Top 0.305: T4.2 105.45,45.09 103.92,46.61 C5.2 103.77,46.54 102.1,44.86 101.79,44.86 101.1,44.18 R46.1 100.95,44.1 99.73,44.1 IC4.2 | v96.15,34.5 96.15,31.76 IC1.10 | C10.2 97.68,64.37 97.68,63.61 95.08,61.02 95.08,55.38 TP9.TP 95.16,56.9 98.82,56.9 | 98.82,56.9 98.82,54.62 99.5,53.93 T1.2 99.58,54.01 100.8,55.23 110.4,55.23 | 98.82,56.9 98.82,57.66 T8.2 | 110.4,55.23 120.99,55.23 T3.2 | v110.4,55.3 110.4,55.23 | v112.69,53.17 114.82,51.03 116.27,51.03 IC3.2 | T9.2 9.44,57.97 9.59,58.12 | 9.59,58.12 10.58,59.11 11.72,59.11 12.87,60.25 12.87,61.4 11.42,62.85 11.19,62.85 T11.2 | v11.34,54.92 11.34,54.01 T7.2 | T10.2 11.19,56.9 v10.96,56.67 | v9.44,58.2 9.51,58.2 9.59,58.12 | v30.39,63 v30.39,61.32 30.47,61.24 30.47,60.64 31.53,59.57 v31.53,58.58 | T6.2 12.94,45.93 16.37,45.93 16.75,45.55 18.2,45.55 20.41,43.34 21.02,43.34 T14.2 21.17,43.26 21.86,43.26 25.06,40.06 25.06,39.3 | 28.41,30.46 27.88,29.93 U$2.P$3 | 28.41,30.46 28.64,30.69 30.54,30.69 R28.2 30.62,30.61 v30.62,29.55 | 23.99,33.43 16.83,40.59 12.94,40.59 T15.2 | 23.99,33.43 23.99,30.84 23.08,29.93 U$2.P$2 | 28.41,30.46 27.04,31.83 27.04,33.74 27.8,34.5 27.95,34.5 28.33,34.88 28.33,35.49 27.95,35.87 26.43,35.87 | 23.99,33.43 26.43,35.87 | 25.06,39.3 25.06,37.24 26.43,35.87 | 27.8,41.28 27.8,41.05 26.05,39.3 25.06,39.3 | 27.8,41.28 v27.8,46.16 | v27.72,41.28 27.8,41.28 | C8.2 32.14,19.49 32.14,23.6 32.68,24.14 C7.2 32.83,24.06 39.31,24.06 40.37,22.99 | 40.37,22.99 40.37,21.62 | 40.37,21.62 40.37,20.25 C9.2 | v51.65,32.82 51.65,33.36 53.56,35.26 54.17,35.26 IC2.10 | v40.45,23.07 40.37,22.99 | v40.45,21.62 40.37,21.62 | IC5.15 73.14,32.75 76.11,32.75 78.4,35.03 79.92,35.03 80.99,33.97 C13.2 81.14,33.81 89.22,33.81 90.89,32.14 90.89,31.37 90.67,31.15 85.33,31.15
  Top 0.305: 78.09,25.58 81.52,25.58 81.83,25.89 81.83,27.41 80.76,28.48 C11.2 80.76,28.63 80.99,28.86 80.99,31.37 C12.2 81.06,31.15 85.33,31.15 | 78.09,25.58 73.14,25.58 IC5.4 | v78.09,25.51 78.09,25.58 | 52.76,21.28 51.73,20.25 51.73,16.29 SV1.8 | 52.76,21.28 54.17,22.69 54.17,23.83 IC2.1 | X4.5 51.88,9.05 51.88,10.19 54.78,13.09 SV1.8 | SV1.8 54.24,12.4 55.99,10.65 55.99,5.85 57.67,4.17 R30.1 57.75,4.09 59.19,4.09 59.65,4.55 IC6.4 59.8,4.48 60.41,3.87 66.05,3.87 66.21,4.02 67.35,4.02 R32.1 67.5,4.09 69.1,4.09 69.86,4.86 72.22,4.86 72.53,4.55 78.4,4.55 81.14,7.3 81.14,10.95 79.84,12.25 | T5.2 109.03,41.28 108.42,40.67 C22.2 108.27,40.67 107.73,40.67 106.51,41.89 103.92,41.89 102.63,40.59 T2.2 | T2.2 102.63,40.52 102.63,38.16 103.01,37.78 C4.2 103.16,37.62 104.08,36.71 107.35,36.71 U$1.P$2 | U$1.P$2 107.43,36.56 107.43,31.91 U$1.P$3 107.35,31.76 98.97,23.37 98.97,20.55 R20.2 98.82,20.4 96.23,20.4 96.15,20.33 IC1.1 96,20.25 95.47,19.72 91.5,19.72 | 112.38,37.62 108.34,37.62 107.51,36.78 U$1.P$2 | 112.38,37.62 112.69,37.62 | 112.69,37.62 113.14,37.62 114.29,36.48 116.12,36.48 C6.2 | C3.2 114.67,38.99 113.6,40.06 112.61,40.06 112.38,39.83 112.38,37.62 | v112.69,37.78 112.69,37.62 | 79.84,12.25 87.31,19.72 91.5,19.72 | 79.84,12.25 77.03,9.43 77.03,9.28 X2.5 | 85.33,31.15 85.33,30.16 88.15,27.34 90.67,27.34 91.5,26.5 91.5,19.72 | 52.76,21.28 v51.35,22.69 | v101.56,40.44 102.48,40.44 T2.2
  Bottom 0.305: v96.15,34.5 100.88,39.22 100.88,40.44 | 100.88,40.44 100.88,41.2 98.51,43.57 98.51,45.32 IC4.2 98.44,45.47 98.44,52.02 95.08,55.38 TP9.TP | v110.4,55.3 111.39,54.31 S3.2 v112.69,53.17 | 23.69,39.83 22.31,38.46 20.79,38.46 S6.2 | 23.69,39.83 25.13,41.28 v27.72,41.28 29.17,41.28 X1.45 | v9.44,58.2 v10.96,56.67 10.96,55.3 v11.34,54.92 14.62,54.92 15.46,55.76 18.12,55.76 19.57,54.31 S4.2 20.87,54.23 20.87,53.93 22.54,52.25 22.54,50.12 T12.2 T13.2 21.48,45.09 21.48,42.04 23.69,39.83 | X1.6 29.17,60.86 29.17,61.24 X1.5 | X1.4 29.17,61.78 29.17,61.4 X1.5 | v30.39,63 30.09,63.3 29.25,63.3 X1.1 | v30.39,61.32 29.32,61.32 X1.5 | X1.12 29.17,57.74 29.17,57.43 X1.13 29.17,57.28 29.17,56.9 X1.14 29.17,56.75 29.17,56.44 X1.15 29.17,56.29 29.17,55.83 X1.16 29.32,55.76 30.01,55.76 | 30.01,55.76 31.08,54.69 31.08,52.41 30.01,51.34 29.32,51.34 X1.25 29.17,51.26 29.17,50.88 X1.26 29.17,50.73 29.17,50.42 X1.27 29.17,50.27 29.17,49.89 X1.28 29.17,49.74 29.17,49.43 X1.29 29.17,49.28 29.17,48.9 X1.30 29.17,48.75 29.17,48.44 X1.31 29.17,48.29 29.17,47.91 X1.32 29.17,47.76 29.17,47.45 X1.33 29.17,47.22 29.17,46.84 X1.34 29.02,46.84 28.49,46.84 v27.8,46.16 | v31.53,58.58 31.53,57.28 30.01,55.76 | v51.65,32.82 50.2,32.82 v40.45,23.07 | S1.2 66.05,21.54 70.17,21.54 71.08,20.63 77.18,20.63 78.09,21.54 S2.2 v78.09,25.51 | v112.69,37.78 111.54,37.78 S5.2 | v51.35,22.69 50.81,22.69 49.75,21.62 46.47,21.62 S7.2 46.32,21.62 v40.45,21.62 40.37,21.7 38.47,21.7 v30.62,29.55 | v101.56,40.44 100.88,40.44
IO1_0  (via drill 0.38)
  Top 0.152: v63.84,23.3 63.84,26.95 64.99,28.1 65.37,28.1 IC5.31
  Bottom 0.152: v63.84,23.3 63.84,19.33 66.13,17.05 S1.4
IO1_1  (via drill 0.38)
  Top 0.152: v71.77,18.65 69.02,21.39 69.02,24.29 65.82,27.49 65.44,27.49 IC5.32
  Bottom 0.152: v71.77,18.65 73.9,18.65 75.5,17.05 S2.4
IO1_2  (via drill 0.38)
  Top 0.152: v70.7,17.58 68.72,19.56 68.72,23.98 65.9,26.8 65.44,26.8 IC5.33 | v74.74,16.97 77.64,16.97 v84.19,23.53
  Bottom 0.152: v70.7,17.58 71.08,17.96 73.9,17.96 74.74,17.13 v74.74,16.97 | v84.19,23.53 86.09,23.53 102.17,39.6 102.17,40.67 100.19,42.65 100.04,42.65 99.66,43.03 99.66,49.13 104.69,54.16 S3.4
IO1_3  (via drill 0.38)
  Top 0.152: v57.59,18.34 59.73,18.34 64.45,23.07 64.45,25.66 64.99,26.19 65.37,26.19 IC5.34 | v20.1,36.33 v22.47,33.97
  Bottom 0.152: v57.59,18.34 55.16,18.34 54.62,18.88 53.56,18.88 52.64,17.96 51.5,17.96 48.91,15.37 39.76,15.37 39,14.61 37.33,14.61 23.61,28.33 23.61,32.82 v22.47,33.97 | v20.1,36.33 19.34,37.09 19.34,51.03 S4.4
IO4_0  (via drill 0.38)
  Top 0.152: v66.66,30.08 70.55,33.97 73.06,33.97 IC5.17 | IC2.3 54.7,26.42 v55.84,25.28 55.84,23.3 53.78,21.24 53.78,18.04 55.84,15.98 55.84,12.48 56.68,11.64 v56.68,9.81 | v19.19,30.38 v19.19,32.06 | v94.48,22.84 96.08,22.84 IC1.3
  Bottom 0.152: v66.66,30.08 63.92,30.08 57.9,24.06 57.06,24.06 v55.84,25.28 | v19.19,32.06 17.51,33.74 16.83,33.74 7.61,42.96 7.61,64.37 7.99,64.75 10.58,64.75 16.75,58.58 18.58,58.58 18.96,58.2 18.96,57.13 18.58,56.75 18.58,55.91 18.96,55.53 19.42,55.53 19.72,55.83 21.48,55.83 22.01,55.3 29.17,55.3 X1.17 | v19.19,30.38 19.57,30.38 40.14,9.81 v56.68,9.81 56.98,10.11 58.89,10.11 60.49,8.51 73.75,8.51 77.25,12.02 87.24,12.02 94.48,19.26 v94.48,22.84
IO4_1  (via drill 0.38)
  Top 0.152: v68.19,32.44 70.4,34.65 73.06,34.65 IC5.18 | IC2.4 54.24,27.72 v58.97,27.72 62.32,24.36 62.32,22 61.94,21.62 60.03,21.62 56.98,18.57 56.98,18.5 v56.22,17.73 | v25.97,54.69 23.3,54.69 20.26,57.74 20.26,61.24 v16.29,65.21 | v93.71,24.14 IC1.4
  Bottom 0.152: v68.19,32.44 63.69,32.44 v58.97,27.72 | v25.97,54.69 26.05,54.77 29.17,54.77 X1.18 | v16.29,65.21 7.99,65.21 7.3,64.52 7.3,42.8 16.68,33.43 16.98,33.43 36.41,14 41.59,14 42.35,14.76 47.38,14.76 | 47.38,14.76 53.25,14.76 v56.22,17.73 | v93.71,24.14 93.33,24.14 86.09,16.9 86.09,16.29 82.13,12.32 77.1,12.32 73.6,8.82 60.64,8.82 59.04,10.42 49.44,10.42 49.21,10.19 48.07,10.19 47.38,10.88 47.38,14.76
IO4_2  (via drill 0.38)
  Top 0.152: v68.19,33.28 70.17,35.26 73.06,35.26 IC5.19 73.14,35.34 73.52,35.72 88.38,35.72 90.97,33.13 v91.66,33.13 | v55.84,31.53 54.24,31.53 IC2.7 | v24.68,51.11 22.62,49.05 19.04,49.05 v18.73,48.75 | v17.51,38.84 17.51,38.54 19.49,36.56 19.49,35.41 v21.17,33.74 | v54.39,18.27 54.39,21.39 v57.67,24.67 | IC1.7 96.61,27.95 97.45,28.78 97.45,29.62 97.14,29.93 94.86,29.93 v93.26,31.53
  Bottom 0.152: v68.19,33.28 63.77,33.28 63.73,33.32 | 63.73,33.32 63.08,33.97 58.28,33.97 v55.84,31.53 | v24.68,51.11 26.43,52.86 26.43,53.55 27.11,54.23 29.17,54.23 X1.19 | v18.73,48.75 18.12,48.14 18.12,39.45 v17.51,38.84 | v21.17,33.74 23.3,31.6 23.3,28.17 37.17,14.31 41.44,14.31 42.2,15.07 53.1,15.07 54.39,16.36 v54.39,18.27 | v57.67,24.67 57.67,27.26 63.73,33.32 | v91.66,33.13 v93.26,31.53
IO4_3  (via drill 0.38)
  Top 0.152: 55.88,34 54.7,32.82 54.24,32.82 IC2.8 | 55.88,34 57.14,35.26 65.37,35.26 IC5.20 | v30.39,53.24 30.39,47.91 v31.99,46.31 | v31.99,36.1 v31.99,40.82 | v44.72,35.87 v40.45,35.87 | v55.84,34.04 55.88,34 | v58.2,36.48 59.27,37.55 88.07,37.55 92.27,33.36 92.27,23.68 94.93,21.01 97.29,21.01 97.45,21.16 97.45,24.52 97.29,24.67 95.08,24.67 94.7,25.05 94.7,28.33 95.54,29.16 96.08,29.16 IC1.8
  Bottom 0.152: v30.39,53.24 29.86,53.78 29.25,53.78 X1.20 | v31.99,40.82 v31.99,46.31 | v31.99,36.1 34.12,33.97 38.93,33.97 40.45,35.49 v40.45,35.87 | v44.72,35.87 54.01,35.87 v55.84,34.04 55.84,34.12 v58.2,36.48
IO4_4  (via drill 0.38)
  Top 0.152: v57.37,34.65 65.37,34.65 IC5.21 | v49.29,34.04 48.07,32.82 47.54,32.82 IC2.13 47.46,32.75 46.85,32.14 v46.01,32.14 | v27.04,53.32 26.5,53.32 25.44,54.39 23.15,54.39 19.95,57.59 19.95,61.09 19.34,61.7 v16.29,61.7 | v15.38,60.79 14.01,60.79 11.72,58.5 10.58,58.5 9.36,57.28 7.3,57.28 v6.69,57.89 | v19.49,29.16 22.31,29.16 22.39,29.09 v25.29,29.09 | v26.66,29.09 27.04,29.09 27.95,28.17 v34.66,28.17 | v74.13,35.11 74.43,35.41 88.23,35.41 91.66,31.98 91.66,30.31 90.59,29.24 89.45,29.24 IC1.13 | v68.41,35.18 67.35,35.18 v66.81,34.65
  Bottom 0.152: v49.29,34.04 52.49,34.04 53.1,33.43 56.15,33.43 v57.37,34.65 v66.81,34.65 | v27.04,53.32 29.17,53.32 X1.21 | v15.38,60.79 v16.29,61.7 | v6.69,57.89 6.69,40.59 15,32.29 15,30.46 15.99,29.47 19.19,29.47 v19.49,29.16 | v26.66,29.09 v25.29,29.09 | v34.66,28.17 34.89,28.17 38.16,31.45 45.33,31.45 v46.01,32.14 | v74.13,35.11 68.49,35.11 v68.41,35.18
IO4_5  (via drill 0.38)
  Top 0.152: 66.17,35.6 65.9,35.87 46.32,35.87 46.16,35.72 46.16,34.96 46.47,34.65 49.52,34.65 49.9,34.27 49.9,33.36 48.07,31.53 47.54,31.53 IC2.14 47.46,31.45 47.23,31.22 v45.94,31.22 | 66.17,35.6 66.21,35.57 66.21,34.42 65.82,34.04 65.44,34.04 IC5.22 | v25.44,50.35 24.37,50.35 22.77,48.75 19.57,48.75 v18.73,47.91 | v17.36,37.85 13.93,34.42 12.26,34.42 12.03,34.19 12.03,33.05 12.18,32.9 15.46,32.9 15.61,33.05 17.59,33.05 18.12,32.52 18.12,30.69 16.14,28.71 16.14,28.02 18.96,25.2 22.92,25.2 28.41,19.72 28.41,18.5 28.79,18.12 34.81,18.12 38.54,21.85 38.93,21.85 39.31,22.23 v39.31,23.07 | IC1.14 88.53,27.95 v86.02,30.46 | v79.54,36.94 67.5,36.94 66.17,35.6
  Bottom 0.152: v25.44,50.35 27.88,52.79 29.17,52.79 X1.22 | v18.73,47.91 18.73,39.22 v17.36,37.85 | v39.31,23.07 39.31,24.44 45.94,31.07 v45.94,31.22 | v79.54,36.94 v86.02,30.46
IO4_6  (via drill 0.38)
  Top 0.152: v62.85,33.36 65.37,33.36 IC5.23 | v27.42,47 27.8,47 29.4,45.4 29.4,36.25 34.2,31.45 39.46,31.45 v41.29,29.62 | v42.35,28.33 46.85,28.33 47.46,27.72 IC2.17 47.54,27.72 v50.66,27.72 51.27,27.11 56.07,27.11 60.95,22.23 v61.71,22.23 | IC1.17 81.9,24.14 v77.64,19.87
  Bottom 0.152: v62.85,33.36 57.21,27.72 v50.66,27.72 | v27.42,47 27.42,51.19 28.49,52.25 29.17,52.25 X1.23 | v41.29,29.62 41.29,29.39 v42.35,28.33 | v77.64,19.87 71.23,19.87 67.5,16.13 64.83,16.13 61.71,19.26 v61.71,22.23
IO4_7  (via drill 0.38)
  Top 0.152: v61.4,32.75 65.37,32.75 IC5.24 | v49.14,27.03 48.15,27.03 IC2.18 | v28.03,48.52 28.03,48.14 30.62,45.55 v30.62,36.78 | v29.63,31.37 32.3,31.37 37.93,25.74 41.29,25.74 44.41,22.61 v44.41,22.31 47.99,18.73 v47.99,11.11 | v74.36,11.33 74.51,11.49 74.51,12.17 85.18,22.84 89.37,22.84 IC1.18
  Bottom 0.152: v61.4,32.75 56.98,28.33 50.43,28.33 v49.14,27.03 v44.41,22.31 | v28.03,48.52 28.03,51.26 28.56,51.8 29.17,51.8 X1.24 | v30.62,36.78 30.62,32.37 v29.63,31.37 | v74.36,11.33 74.36,10.27 73.22,9.12 60.79,9.12 59.19,10.72 49.29,10.72 49.06,10.5 48.6,10.5 v47.99,11.11
LADC  (via drill 0.38)
  Top 0.152: 58.05,8.9 59.19,8.9 59.65,8.44 IC6.1 | 58.05,8.9 57.75,8.9 R29.2 58.05,8.9 | v74.21,28.1 74.21,29.39 73.52,30.08 73.14,30.08 IC5.11 | v64.45,20.02 58.36,13.92 58.36,10.04 58.05,9.73 58.05,8.9
  Bottom 0.152: v74.21,28.1 74.21,27.26 75.04,26.42 75.04,24.29 73.22,22.46 71.54,22.46 70.55,23.45 70.55,23.91 70.17,24.29 66.51,24.29 64.45,22.23 v64.45,20.02
LCLOCK  (via drill 0.38)
  Top 0.152: v75.58,14.08 84.95,23.45 90.51,23.45 90.82,23.75 90.82,24.52 89.98,25.35 89.45,25.35 IC1.16 | v75.58,11.64 75.58,9.43 75.43,9.28 X2.3
  Bottom 0.152: v75.58,11.64 v75.58,14.08
LCLR
  Top 0.152: IC1.19 89.37,21.54 84.34,21.54 74.97,12.17 74.97,10.95 74.59,10.57 74.59,9.28 X2.2
LD_/C  (via drill 0.38)
  Top 0.152: v30.85,59.26 v25.13,64.98 23.76,66.35 10.81,66.35 8.6,64.14 v8.22,64.14 | v57.29,29.47 IC5.29 | v28.79,28.78 v29.63,29.62
  Bottom 0.152: v25.13,64.98 18.5,64.98 R47.1 | v30.85,59.26 29.25,59.26 X1.9 | v57.29,29.47 56.6,29.47 52.64,33.43 39.76,33.43 38.09,31.76 31.76,31.76 v29.63,29.62 | v28.79,28.78 28.79,29.16 28.41,29.55 28.41,30 23.53,34.88 17.36,34.88 8.22,44.02 v8.22,64.14
LDIN
  Top 0.152: IC1.15 89.45,26.65 89.98,26.65 91.12,25.51 91.12,21.54 90.44,20.86 84.11,20.86 76.19,12.93 76.19,9.28 X2.4
LEDK1
  Bottom 0.152: R37.2 22.92,53.55 22.92,50.96 23.91,49.97 23.91,49.21 27.8,45.32 29.17,45.32 X1.37
LEDK2  (via drill 0.38)
  Top 0.152: v25.06,47.22 24.45,47.83 19.95,47.83 19.11,47 12.79,47 12.26,46.46 12.26,45.47 12.71,45.01 12.71,44.1 R38.2
  Bottom 0.152: v25.06,47.22 25.44,47.22 27.8,44.86 29.17,44.86 X1.38
LEDK3
  Bottom 0.152: R39.2 29.17,44.33 X1.39
LEDK4
  Bottom 0.152: R40.2 24.37,41.81 26.58,41.81 28.56,43.8 29.17,43.8 X1.40
LHVTRIG  (via drill 0.38)
  Top 0.152: v106.36,29.32 109.26,29.32 110.1,28.48 110.78,28.48 R13.1 | v62.62,6.91 62.62,8.29 v66.13,11.79 | v61.1,20.55 61.33,20.55 63.23,22.46 63.23,27.03 64.99,28.78 65.37,28.78 IC5.30
  Bottom 0.152: v106.36,29.32 104.99,29.32 86.25,10.57 84.72,10.57 82.97,8.82 82.97,7.98 79.62,4.63 63.61,4.63 62.62,5.62 v62.62,6.91 | v66.13,11.79 66.13,14.38 61.1,19.41 v61.1,20.55
LLED  (via drill 0.38)
  Top 0.152: R44.1 16.9,44.02 16.75,43.87 16.75,41.59 R42.1 16.83,41.59 18.05,41.59 18.81,40.82 19.8,40.82 20.49,41.51 R43.1 20.56,41.51 22.39,39.68 22.85,39.68 R41.1 22.92,39.6 22.92,39.22 v24.37,37.78 | v68.8,31.37 73.06,31.37 IC5.13 | v50.66,23.75 48.53,25.89 43.35,25.89 v41.52,27.72 | v38.39,30.84 33.74,30.84 v26.81,37.78
  Bottom 0.152: v68.8,31.37 61.18,23.75 v50.66,23.75 | v38.39,30.84 v41.52,27.72 | v24.37,37.78 v26.81,37.78
LOPA  (via drill 0.38)
  Top 0.152: U$1.P$4 110.32,31.83 109.64,31.15 107.35,31.15 102.93,26.73 102.93,23.37 98.89,19.33 98.89,19.18 R20.1 98.82,19.11 95.69,19.11 91.2,14.61 88.76,14.61 v82.36,8.21 | v63.23,5.85 IC6.3
  Bottom 0.152: v63.23,5.85 70.55,5.85 72.91,8.21 v82.36,8.21
LRD  (via drill 0.38)
  Top 0.152: IC5.10 71.01,29.47 69.94,28.4 v69.94,23.68 | v66.13,22.76 66.13,19.11 60.87,13.85 60.87,11.71 v58.66,9.51 | v6.08,58.96 6.46,58.96 7.61,60.1 v11.04,60.1 | v14.39,60.1 15.23,60.1 v19.19,56.14
  Bottom 0.152: X1.11 29.17,58.35 28.49,58.35 28.26,58.58 28.26,60.03 27.95,60.33 27.95,61.09 25.82,63.23 22.54,63.23 18.66,59.34 18.5,59.34 R50.1 18.73,59.34 19.27,58.81 19.27,56.98 19.19,56.9 v19.19,56.14 | v69.94,23.68 67.04,23.68 v66.13,22.76 | v58.66,9.51 57.21,9.51 56.3,8.59 39.99,8.59 20.03,28.56 18.43,28.56 17.82,29.16 15.84,29.16 7.07,37.93 7.07,39.76 6.08,40.75 v6.08,58.96 | v14.39,60.1 v11.04,60.1
LRESET  (via drill 0.38)
  Top 0.152: v42.89,29.55 48.68,29.55 49.82,28.4 55.38,28.4 58.36,31.37 65.37,31.37 IC5.26 | v39.84,30.23 33.9,30.23 31.46,32.67 v28.87,32.67 | v21.7,49.66 22.39,49.66 v23.84,51.11 | v24.83,52.63 24.45,52.63 19.65,57.43 19.65,60.56 v19.34,60.86
  Bottom 0.152: v42.89,29.55 42.2,29.55 41.52,30.23 v39.84,30.23 | v28.87,32.67 26.66,32.67 22.39,36.94 19.95,36.94 19.88,37.01 19.88,44.71 21.7,46.54 v21.7,49.66 | v23.84,51.11 24.83,52.1 v24.83,52.63 | v19.34,60.86 19.72,60.86 22.39,63.53 25.97,63.53 28.26,61.24 28.26,60.56 28.49,60.33 29.17,60.33 X1.7
LTS+
  Top 0.152: X3.1 87.92,2.8 87.92,4.86 98.21,15.14 99.28,15.14 99.43,14.99 99.43,13.92 98.74,13.24 R12.2 98.74,11.79 101.87,8.67 101.87,5.85 103.92,3.79 120.46,3.79 121.68,5.01 121.68,9.51 F1.P$4
LTS-
  Top 0.152: R12.1 98.74,14.46 92.65,8.36 92.65,6 X3.5
  Bottom 0.152: F1.P$3 121.68,19.72 121.68,23.98 116.65,29.01 106.9,29.01 93.48,15.6 93.48,6.84 92.65,6 X3.5
LVSEL
  Top 0.152: IC5.14 73.14,32.06 78.02,32.06 78.32,32.37 88.76,32.37 89.37,31.76 IC1.11
LWR  (via drill 0.38)
  Top 0.152: v17.89,60.25 17.89,59.72 19.34,58.27 19.34,57.28 26.58,50.04 27.04,50.04 27.23,50.23 | 27.23,50.23 29.78,52.79 29.78,57.13 v30.39,57.74 | v72.07,28.86 73.06,28.86 IC5.9 | v34.28,33.13 32.6,34.8 32.6,44.86 27.23,50.23
  Bottom 0.152: v17.89,60.25 18.43,60.79 18.43,61.17 R49.1 | v30.39,57.74 30.39,58.27 29.93,58.73 29.25,58.73 X1.10 | v72.07,28.86 72.07,30.69 65.37,37.39 42.81,37.39 38.54,33.13 v34.28,33.13
N$1  (via drill 0.38)
  Top 0.152: v96.99,48.98 97.14,49.13 97.83,49.13 R1.1 | v94.32,46.31 94.32,33.43 92.65,31.76 92.65,23.83 94.86,21.62 96.08,21.62 IC1.2
  Bottom 0.152: v94.32,46.31 v96.99,48.98
N$2
  Top 0.152: R2.1 99.12,25.43 96.15,25.43 IC1.5
N$3
  Top 0.152: R3.1 98.82,28.94 96.61,26.73 96.15,26.73 IC1.6
N$4
  Top 0.152: R4.1 99.12,32.44 98.51,32.44 96.61,30.54 96.15,30.54 IC1.9
N$5  (via drill 0.38)
  Top 0.152: v95.92,38.08 101.1,43.26 102.1,43.26 102.7,42.65 105.83,42.65 107.73,44.56 107.73,45.01 108.5,45.78 109.49,45.78 110.48,44.79 111.54,44.79 R5.1 | v91.05,30.54 89.45,30.54 IC1.12
  Bottom 0.152: v95.92,38.08 95.77,38.08 91.05,33.36 v91.05,30.54
N$6
  Top 0.152: T8.1 97.83,59.72 101.33,63.23 104.53,63.23 106.51,61.24 106.51,60.94 108.04,59.42 L3.2 108.12,59.42 109.26,60.56 112.38,60.56 SG1.-
N$7
  Top 0.152: T4.3 108.72,45.09 105.91,42.27 102.55,42.27 101.49,41.2 100.19,41.2 99.12,40.14 R4.2
N$8
  Top 0.152: T5.3 113.75,41.28 111.62,43.41 R5.2
N$9
  Top 0.152: 105.68,27.41 105.68,26.95 103.24,24.52 103.24,20.25 F1.P$1 | 105.68,27.41 105.68,28.4 D2.A | 105.68,27.41 117.94,27.41 121.91,31.37 H1.4
N$10
  Top 0.152: T1.1 102.25,52.94 R7.1
N$11  (via drill 0.38)
  Top 0.152: v96.76,37.85 96.76,38.23 101.03,42.5 101.64,42.5 T2.1 | v94.93,47.83 v94.93,36.02 | v96.91,49.81 96.91,52.33 96.76,52.48 96.76,54.08 v97.07,54.39 | v120.54,50.58 121.3,49.81 R8.1
  Bottom 0.152: v94.93,36.02 v96.76,37.85 | v96.91,49.81 v94.93,47.83 | v97.07,54.39 97.07,58.73 95.77,60.03 95.77,60.48 98.51,63.23 118.1,63.23 120.54,60.79 v120.54,50.58
N$12
  Top 0.152: T3.1 121.98,53.17 121.98,52.33 121.37,51.72 R9.1
N$13
  Top 0.152: T1.3 99.5,49.51 99.2,49.21 R1.2
N$14
  Top 0.152: T2.3 100.72,40.52 100.72,39.83 101.33,39.22 101.33,28.94 99.12,26.73 R2.2
N$15
  Top 0.152: T3.3 122.97,55.23 122.21,55.23 121.53,54.54 119.77,54.54 119.62,54.69 104.15,54.69 102.93,53.47 102.93,52.48 101.87,51.42 101.18,51.42 100.88,51.11 100.88,48.67 98.44,46.23 97.45,46.23 95.31,44.1 95.31,36.48 98.67,33.13 99.66,33.13 99.81,32.97 99.81,30.99 99.12,30.31 R3.2
N$16
  Top 0.152: T4.1 108.04,43.11 110.1,43.11 111.09,44.1 112.69,44.1 113.37,44.79 115.81,44.79 117.94,42.65 119.16,42.65 120.69,44.18 120.69,46.61 121.3,47.22 R10.1
N$17
  Top 0.152: C1.2 103.85,50.42 103.62,50.65 103.62,52.94 R7.2 103.7,52.94 111.62,52.94 113.07,54.39 119.47,54.39 119.93,53.93 122.52,53.93 122.67,53.78 122.67,51.72 R9.2 122.67,51.64 122.67,49.81 R8.2 122.67,49.74 122.67,47.3 R10.2 122.67,47.22 122.67,44.71 R11.2 122.59,44.71 121.98,44.1 IC7.7
N$18  (via drill 0.38)
  Top 0.152: 102.02,47.61 102.02,50.42 C1.1 | 102.02,47.61 102.02,46.61 C5.1 | 121.56,37.74 120.76,36.94 120.76,36.4 IC7.1 120.69,36.4 119.01,36.4 C6.1 | 121.56,37.74 121.6,37.78 124.88,37.78 125.11,37.55 125.11,35.18 124.65,34.73 119.16,34.73 118.55,34.12 118.55,31.37 114.9,27.72 110.4,27.72 109.72,28.4 108.27,28.4 D2.C 108.19,28.4 v107.12,28.4 | 121.56,37.74 121.37,37.93 121.37,44.71 R11.1 121.3,44.71 v121.3,45.7 | 102.02,47.61 115.96,47.61 v117.87,45.7
  Bottom 0.152: v107.12,28.4 101.71,22.99 101.71,18.95 102.63,18.04 102.63,9.58 F1.P$2 | v121.3,45.7 v117.87,45.7
N$19
  Top 0.152: 8.86,28.36 5.85,31.37 H2.4 | 8.86,28.36 8.9,28.33 14.01,28.33 14.85,29.16 15.15,29.16 D1.A | 8.86,28.36 5.17,24.67 5.17,19.94 F2.P$1
N$20  (via drill 0.38)
  Top 0.152: v8.52,42.88 8.52,45.55 R15.1 | v52.41,18.57 52.41,20.33 55.54,23.45 55.54,24.29 54.7,25.13 54.24,25.13 IC2.2
  Bottom 0.152: v8.52,42.88 8.9,42.88 17.21,34.57 23.38,34.57 28.11,29.85 28.11,28.63 37.86,18.88 42.43,18.88 45.17,16.13 49.21,16.13 51.65,18.57 v52.41,18.57
N$21
  Top 0.152: R13.2 112.15,28.48 112.15,31.15 114.59,33.58 H1.1
N$22
  Top 0.152: T8.3 96.91,57.66 96.91,59.95 97.83,60.86 97.83,61.17 R14.2
N$23
  Top 0.305: U$1.P$1 110.4,36.63 113.45,36.63 115.81,34.27 115.81,30.31 114.67,29.16 H1.3
N$24
  Top 0.152: R16.1 15.38,50.42 18.5,47.3 18.96,47.3 20.1,48.44 25.13,48.44 25.51,48.82 26.43,48.82 29.71,45.55 29.71,36.4 34.35,31.76 44.56,31.76 45.71,30.61 46.16,30.61 46.32,30.76 50.13,30.76 51.88,29.01 54.17,29.01 IC2.5
N$25  (via drill 0.38)
  Top 0.152: v6.46,39.53 6.46,46.08 6.69,46.31 6.77,46.31 7.53,47.07 7.53,48.14 8.29,48.9 8.29,49.89 R17.1 | v29.02,18.73 29.17,18.73 29.48,18.42 34.66,18.42 v38.7,22.46 | IC2.6 v51.5,30.23
  Bottom 0.152: v6.46,39.53 6.46,38.08 15.68,28.86 17.67,28.86 21.32,25.2 22.92,25.2 29.02,19.11 v29.02,18.73 | v38.7,22.46 43.73,22.46 v51.5,30.23
N$26  (via drill 0.38)
  Top 0.152: v9.13,39.99 v9.13,43.95 | v43.27,9.2 43.27,10.8 41.36,12.71 41.36,19.03 42.13,19.79 v42.13,23.07 | v52.49,32.75 52.79,33.05 52.79,33.13 53.71,34.04 IC2.9
  Bottom 0.152: R18.1 18.2,57.66 17.51,56.98 11.49,56.98 9.66,58.81 9.21,58.81 8.83,58.43 8.83,44.25 v9.13,43.95 | v9.13,39.99 9.13,38.61 15.3,32.44 15.3,30.61 16.14,29.77 19.72,29.77 40.3,9.2 v43.27,9.2 | v42.13,23.07 42.28,23.07 51.42,32.21 51.96,32.21 v52.49,32.75
N$27  (via drill 0.38)
  Top 0.152: v21.93,53.85 21.93,54.23 19.04,57.13 19.04,58.12 12.79,64.37 12.79,65.13 R19.1 | v25.82,53.17 25.82,51.64 v26.81,50.65 | v26.81,49.28 26.81,48.9 30.01,45.7 30.01,36.56 34.05,32.52 45.55,32.52 47.08,34.04 IC2.12
  Bottom 0.152: v21.93,53.85 22.39,54.31 24.68,54.31 v25.82,53.17 | v26.81,49.28 v26.81,50.65
N$28  (via drill 0.38)
  Top 0.152: v24.22,47.22 19.8,47.22 18.81,46.23 v17.51,46.23 | v16.29,45.01 16.29,44.71 15.68,44.1 R44.2
  Bottom 0.152: v24.22,47.22 24.52,46.92 24.52,46.23 T13.3 | v16.29,45.01 v17.51,46.23
N$29
  Top 0.152: T6.3 10.96,46 9.21,46 8.9,46.31 7.91,46.31 7.23,45.62 R15.2
N$30
  Top 0.152: T7.3 13.25,53.93 13.09,53.93 11.49,52.33 11.49,50.42 R16.2
N$31
  Top 0.152: T9.3 8.45,56.06 11.26,56.06 11.65,56.44 12.64,56.44 12.79,56.29 12.79,54.69 11.95,53.85 11.95,53.4 9.21,50.65 7.76,50.65 7.07,49.97 R17.2
N$32  (via drill 0.38)
  Top 0.152: v16.22,57.74 13.17,57.74 T10.3
  Bottom 0.152: v16.22,57.74 16.98,57.74 R18.2
N$33
  Top 0.152: T11.3 13.09,62.92 13.09,63.53 11.49,65.13 R19.2
N$35
  Top 0.152: T6.1 11.95,47.99 11.95,45.7 10.27,44.02 10.27,38.99 R22.1
N$36
  Top 0.152: T7.1 12.26,51.95 12.26,51.03 12.1,50.88 12.1,49.89 9.89,47.68 8.22,47.68 R23.1
N$37
  Top 0.152: T9.1 6.46,56.98 6.46,56.06 7.68,54.84 7.68,52.56 7.07,51.95 R24.1
N$38
  Top 0.152: T10.1 9.74,55.76 8.37,54.39 R25.1
N$39
  Top 0.152: 6.88,50.92 7.23,51.26 7.61,51.26 8.29,51.95 R24.2 | 6.88,50.92 6.39,50.42 6.39,49.43 6.85,48.98 6.85,47.68 R23.2 6.85,47.61 6.85,46.92 4.56,44.63 4.56,41.66 IC8.7 4.56,41.59 4.56,40.59 6.24,38.92 8.98,38.92 R22.2 8.98,38.99 9.66,38.31 13.32,38.31 13.36,38.35 | 6.88,50.92 6.39,51.42 6.39,52.48 7,53.09 7,54.31 R25.2 | 13.36,38.35 14.01,38.99 R26.2 | 13.36,38.35 13.7,38 13.7,36.48 C2.2
N$40  (via drill 0.38)
  Top 0.152: C8.1 30.16,19.49 30.16,23.91 29.93,24.14 C7.1 29.86,24.14 28.49,25.51 22.31,25.51 18.66,29.16 17.74,29.16 D1.C 17.67,29.16 v16.75,28.25 | R26.1 12.79,38.99 13.47,39.68 14.54,39.68 14.69,39.53 14.69,35.64 14.47,35.41 12.87,35.41 11.87,36.4 C2.1 11.8,36.4 10.46,35.07 | 3.68,35.45 4.1,35.03 10.43,35.03 10.46,35.07 | 3.68,35.45 3.26,35.87 3.26,36.33 IC8.1 | 3.68,35.45 2.43,34.19 2.43,20.94 5.09,18.27 5.09,9.81 F2.P$2 | v10.5,33.2 10.5,35.03 10.46,35.07
  Bottom 0.152: v16.75,28.25 15.46,28.25 v10.5,33.2
N$41
  Bottom 0.152: T12.1 23.61,52.1 23.61,53.02 24.14,53.55 R37.1
N$42
  Top 0.152: R21.2 16.14,31.98 15.99,31.98 13.17,29.16 H2.1
N$43
  Top 0.152: T15.1 11.95,42.73 11.95,43.57 11.49,44.02 R38.1
N$44  (via drill 0.38)
  Top 0.152: v22.16,44.79 21.63,45.32 20.1,45.32 T14.1
  Bottom 0.152: v22.16,44.79 22.54,44.79 23,44.33 R39.1
N$45
  Top 0.152: T5.1 113.14,39.22 113.83,39.22 115.43,37.62 117.03,37.62 117.87,36.78 117.87,35.49 118.33,35.03 123.66,35.03 124.5,35.87 124.5,36.33 IC7.4
N$46
  Bottom 0.152: T13.1 23.61,48.21 23.61,44.94 23.69,44.86 23.69,42.42 23.08,41.81 R40.1
N$47
  Top 0.152: T11.1 12.1,60.79 12.1,60.33 11.26,59.49 7.45,59.49 3.95,55.99 3.95,39.99 7,36.94 7,36.4 IC8.4
N$48
  Top 0.152: T14.3 19.19,43.26 19.19,41.59 R43.2
N$49  (via drill 0.38)
  Top 0.152: v25.74,39.99 v25.74,48.21 | v24.37,38.61 24.37,39.45 24.22,39.6 R41.2
  Bottom 0.152: v25.74,48.21 24.6,49.36 24.6,50.04 T12.3 | v24.37,38.61 v25.74,39.99
N$50
  Top 0.152: T15.3 11.04,40.67 11.8,40.67 12.64,41.51 15.38,41.51 R42.2
N$51
  Top 0.305: U$2.P$1 23,32.9 18.35,32.9 17.67,33.58 13.17,33.58 H2.3
N$52
  Top 0.152: 67.42,5.85 67.42,7.6 R31.1 | 67.42,5.85 67.42,5.39 R32.2 | IC6.6 67.42,5.85
N$54
  Top 0.152: 57.75,7.07 57.75,7.6 R29.1 | 57.75,7.07 57.75,5.39 R30.2 | 57.75,7.07 59.65,7.07 IC6.2
RADC  (via drill 0.38)
  Top 0.152: IC6.7 64.91,7.14 65.44,7.14 67.2,8.9 67.35,8.9 R31.2 67.42,8.97 v68.87,10.42 | v77.33,36.33 70.4,36.33 67.58,33.51 67.58,32.52 65.9,30.84 65.44,30.84 IC5.27 | v80.68,23.75 73.9,16.97 v73.9,12.32
  Bottom 0.152: v77.33,36.33 77.33,34.42 80.68,31.07 v80.68,23.75 | v73.9,12.32 72,10.42 v68.87,10.42
RCLOCK
  Top 0.152: IC2.16 47.46,28.94 41.9,28.94 40.91,27.95 40.91,27.11 50.2,17.81 50.2,9.05 X4.3
RCLR
  Top 0.152: IC2.19 47.54,25.13 48.07,25.13 50.97,22.23 50.97,9.05 X4.4
RDIN
  Top 0.152: IC2.15 42.74,30.23 40.6,28.1 40.6,26.95 49.44,18.12 49.44,9.05 X4.2
RHVTRIG  (via drill 0.38)
  Top 0.152: v11.04,29.85 12.87,29.85 15.76,32.75 16.6,32.75 17.28,32.06 17.44,32.06 R21.1 | v68.34,7.9 68.34,9.05 69.63,10.34 69.63,10.88 70.17,11.41 70.47,11.41 71.54,12.48 71.54,17.58 72.38,18.42 72.38,24.59 72.68,24.9 73.06,24.9 IC5.3
  Bottom 0.152: v11.04,29.85 4.18,22.99 4.18,6 6.39,3.79 22.92,3.79 25.29,6.15 25.29,7.75 27.65,10.11 31.76,10.11 34.35,7.52 67.96,7.52 v68.34,7.9
ROPA  (via drill 0.38)
  Top 0.152: R28.1 30.54,32.06 28.64,32.06 27.88,32.82 U$2.P$4 27.88,32.9 28.56,33.58 v28.56,34.12 | v61.33,4.55 64.83,4.55 IC6.5 | v44.95,6.69 35.34,16.29 v35.34,17.81 | v25.29,31.83 25.29,33.66 v25.9,34.27
  Bottom 0.152: v61.33,4.55 53.1,4.55 52.95,4.4 47.23,4.4 v44.95,6.69 | v35.34,17.81 35.34,20.94 27.27,29.01 27.27,29.85 v25.29,31.83 | v25.9,34.27 28.41,34.27 v28.56,34.12
RTS+
  Top 0.152: F2.P$4 27.76,13.35 | 27.76,13.35 28.11,13.7 28.11,14.15 R27.2 | 27.76,13.35 X5.1
RTS-
  Top 0.152: F2.P$3 24.22,19.94 28.11,16.06 28.11,15.52 R27.1 28.18,15.45 31.46,15.45 41.14,5.77 43.27,5.77 X5.5
RVSEL
  Top 0.152: IC5.25 65.37,32.14 51.5,32.14 50.2,33.43 50.2,34.42 49.36,35.26 47.54,35.26 IC2.11
SPKR  (via drill 0.38)
  Top 0.152: v96.38,60.25 96.53,60.41 96.53,61.17 R14.1 | v76.34,28.1 76.19,28.1 73.52,30.76 73.14,30.76 IC5.12
  Bottom 0.152: v96.38,60.25 101.26,55.38 105.98,55.38 106.29,55.68 107.73,55.68 107.89,55.53 107.89,44.02 101.1,37.24 100.27,37.24 85.86,22.84 80.3,22.84 78.7,24.44 78.7,25.74 v76.34,28.1
TCK
  Top 0.152: SV1.3 67.5,23.91 65.9,25.51 65.44,25.51 IC5.35
  Bottom 0.152: SV1.3 67.5,15.22 71.54,19.26 78.02,19.26 81.22,22.46 85.94,22.46 100.42,36.94 101.26,36.94 101.94,37.62 106.97,37.62 S5.4
TDI
  Top 0.152: IC5.37 65.44,24.21 65.9,24.21 66.74,23.37 66.74,17.51 62.47,13.24 SV1.5
  Bottom 0.152: S7.4 49.67,17.05 51.8,19.18 57.59,19.18 62.4,14.38 62.4,13.24 SV1.5
TDO
  Top 0.152: SV1.6 59.88,13.32 65.37,18.8 65.37,23.6 IC5.38
TEST
  Top 0.152: SV1.1 73.06,13.7 73.06,23.6 IC5.1
TMS
  Top 0.152: SV1.4 67.04,15.3 67.04,23.68 65.82,24.9 65.44,24.9 IC5.36
  Bottom 0.152: S6.4 16.22,38.23 16.75,37.7 16.75,37.62 19.19,35.18 23.69,35.18 29.02,29.85 29.02,29.39 38.93,19.49 58.66,19.49 64.91,13.24 SV1.4
VBAT  (via drill 0.38)
  Top 0.152: 96.69,40.82 96,41.51 R45.1 | 96.69,40.82 97.83,40.82 v100.27,43.26 | v103.01,43.26 102.25,44.02 R46.2 | v71.77,23.07 69.71,23.07 69.33,23.45 69.33,26.57 65.82,30.08 65.44,30.08 IC5.28 | 96.69,40.82 v96.38,40.52
  Bottom 0.152: v103.01,43.26 v100.27,43.26 | v71.77,23.07 73.37,23.07 74.74,24.44 74.74,26.27 73.6,27.41 73.6,29.32 77.56,33.28 78.02,33.28 80.07,31.22 80.07,23.53 80.45,23.14 80.91,23.14 90.74,32.97 90.74,34.88 v96.38,40.52
VCC  (via drill 0.38)
  Top 0.305: v48.83,11.11 48.68,10.95 48.68,9.05 X4.1 | v72.99,9.73 73.29,9.73 73.75,9.28 X2.1 | C10.1 100.57,64.37 105.45,64.37 107.96,61.85 L3.1 108.12,61.85 111.62,61.85 111.77,62.01 117.49,62.01 118.86,60.64 SG1.+ | v118.55,47.38 118.55,43.8 IC3.3
  Bottom 0.305: v48.83,11.11 67.2,11.11 67.88,10.42 | 67.88,10.42 68.57,9.73 v72.99,9.73 | SG1.+ 118.55,60.25 v118.55,47.38 110.55,39.38 110.55,38.16 107.96,35.57 104.15,35.57 89.22,20.63 85.79,20.63 80.23,15.07 72.15,15.07 71.46,14.38 71.46,12.32 70.47,11.33 68.8,11.33 67.88,10.42
XIN
  Top 0.152: IC5.6 73.14,26.88 76.64,26.88 Q3.2 78.17,28.48 79.08,29.39 79.08,31.37 C12.1
XOUT
  Top 0.152: 78.17,26.65 77.79,26.27 73.14,26.27 IC5.5 | 78.17,26.65 80.68,26.65 C11.1 | 78.17,26.65 Q3.1

### Text on the board
DrillLegend: LAYER-STACK
DrillLegend_01-16: 01-16
DrillLegend_01-20: 01-20